# EAGLE design working (EAGLE 9.6.2)
COMPANY: ADAFRUIT INDUSTRIES; DRAWN: KTOWN; REV: A
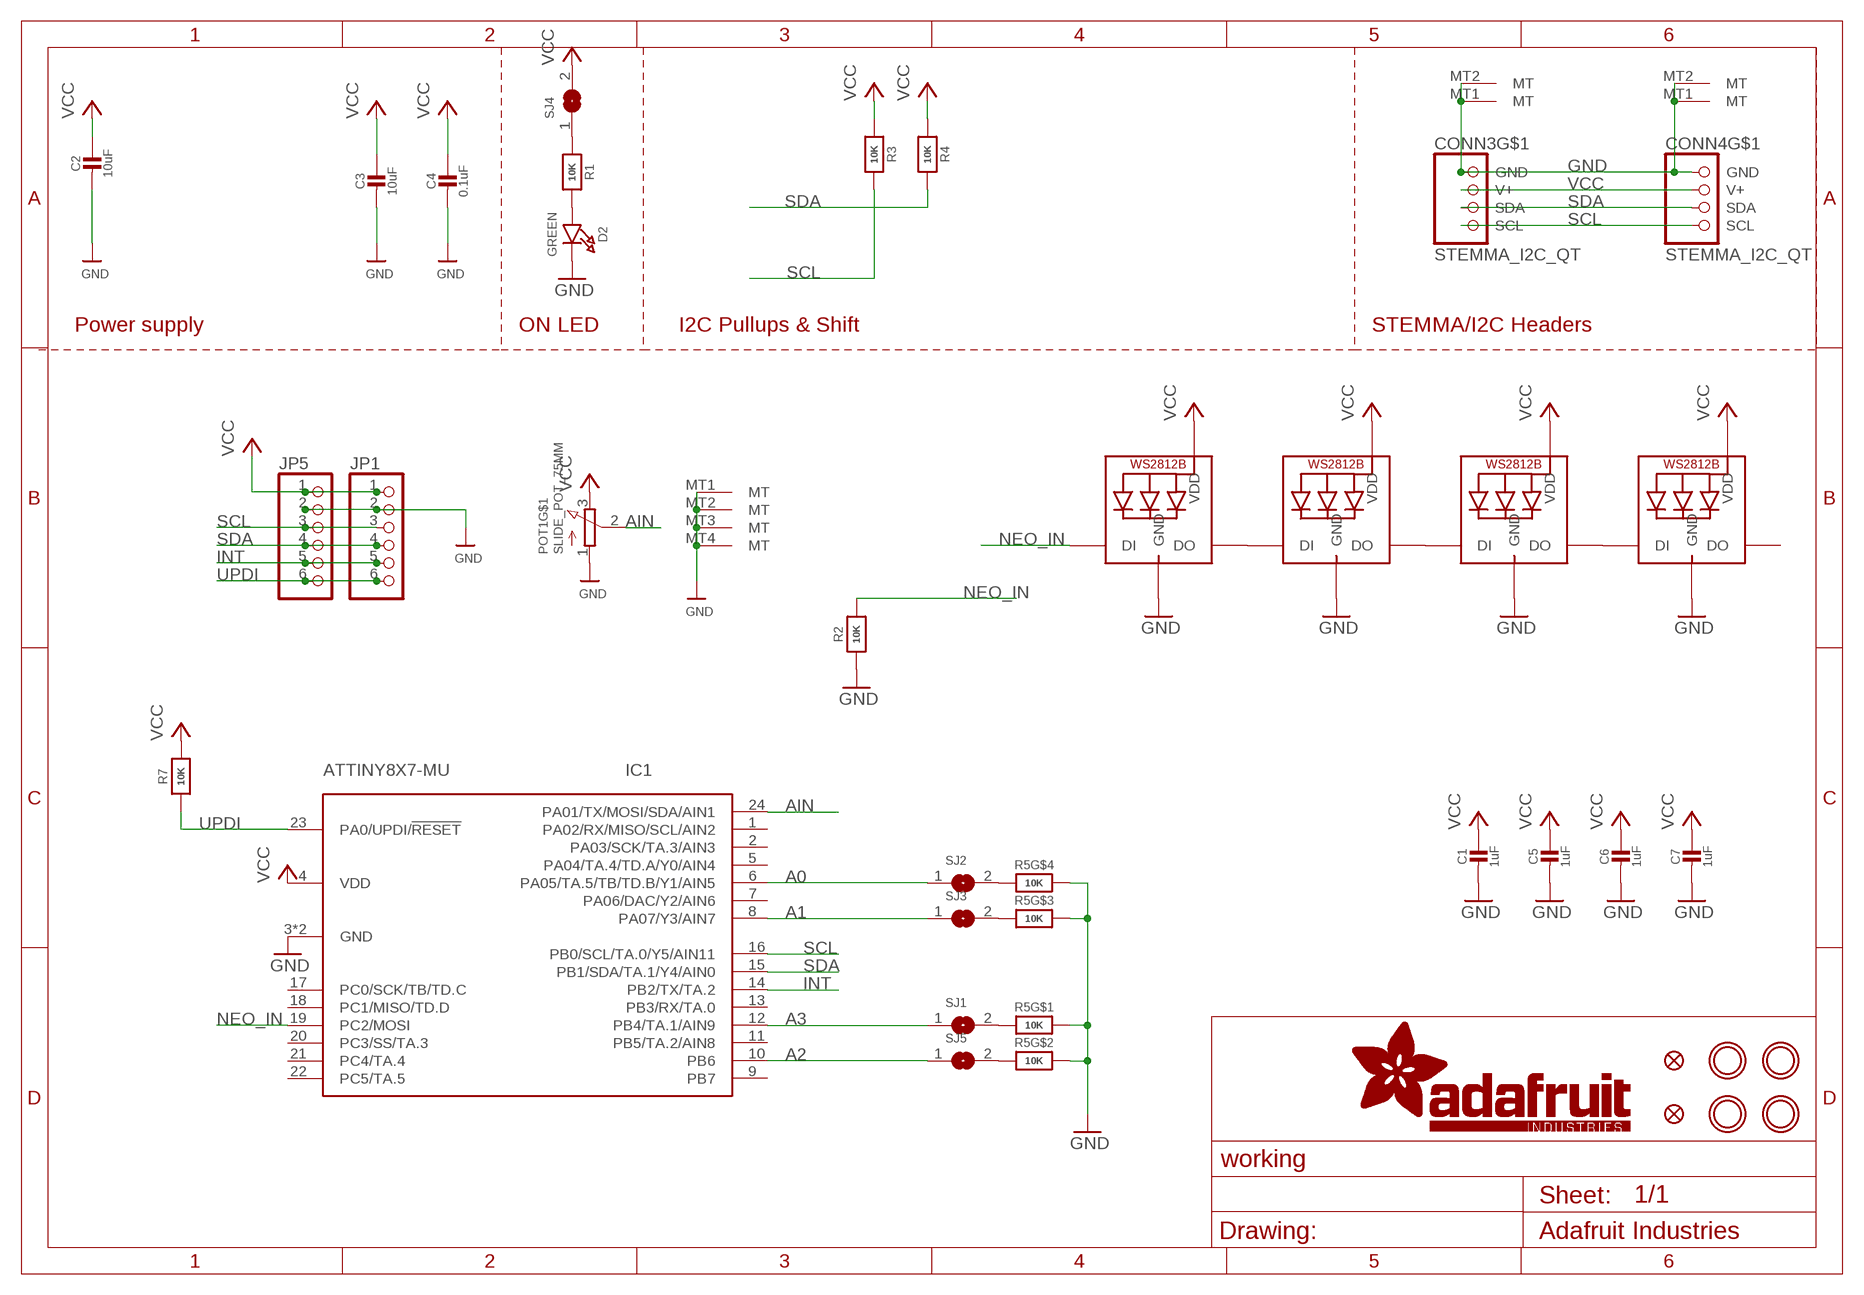
[diagram p0: schematic, sheet 1]

## Parts
C1  1uF  CAP_CERAMIC0603_NO  [0603-NO]
C2  10uF  CAP_CERAMIC0805-NOOUTLINE  [0805-NO]
C3  10uF  CAP_CERAMIC0805-NOOUTLINE  [0805-NO]
C4  0.1uF  CAP_CERAMIC0603_NO  [0603-NO]
C5  1uF  CAP_CERAMIC0603_NO  [0603-NO]
C6  1uF  CAP_CERAMIC0603_NO  [0603-NO]
C7  1uF  CAP_CERAMIC0603_NO  [0603-NO]
CONN3  STEMMA_I2C_QT  [JST_SH4]
CONN4  STEMMA_I2C_QT  [JST_SH4]
D2  GREEN  LED0603_NOOUTLINE  [CHIPLED_0603_NOOUTLINE]
FID1  FIDUCIAL_1MM  [FIDUCIAL_1MM]
FID2  FIDUCIAL_1MM  [FIDUCIAL_1MM]
IC1  ATTINY8X7-MU  [QFN24_4MM]
JP1  HEADER-1X670MIL  [1X06_ROUND_70]
JP5  HEADER-1X670MIL  [1X06_ROUND_70]
LED1  WS2812B_SK6812E  [NEO3535_REVERSE]
LED2  WS2812B_SK6812E  [NEO3535_REVERSE]
LED3  WS2812B_SK6812E  [NEO3535_REVERSE]
LED4  WS2812B_SK6812E  [NEO3535_REVERSE]
POT1  SLIDE_POT_75MM  [SLIDE_POT_75MM]
R1  10K  RESISTOR_0603_NOOUT  [0603-NO]
R2  10K  RESISTOR_0603_NOOUT  [0603-NO]
R3  10K  RESISTOR_0603_NOOUT  [0603-NO]
R4  10K  RESISTOR_0603_NOOUT  [0603-NO]
R5  10K  RESISTOR_4PACK  [RESPACK_4X0603]
R7  10K  RESISTOR_0603_NOOUT  [0603-NO]
SJ1  SOLDERJUMPERCLOSED  [SOLDERJUMPER_CLOSEDWIRE]
SJ2  SOLDERJUMPERCLOSED  [SOLDERJUMPER_CLOSEDWIRE]
SJ3  SOLDERJUMPERCLOSED  [SOLDERJUMPER_CLOSEDWIRE]
SJ4  SOLDERJUMPERCLOSED  [SOLDERJUMPER_CLOSEDWIRE]
SJ5  SOLDERJUMPERCLOSED  [SOLDERJUMPER_CLOSEDWIRE]
U$3  MOUNTINGHOLE2.5  [MOUNTINGHOLE_2.5_PLATED]
U$17  MOUNTINGHOLE2.5  [MOUNTINGHOLE_2.5_PLATED]
U$19  MOUNTINGHOLE2.5  [MOUNTINGHOLE_2.5_PLATED]
U$21  MOUNTINGHOLE2.5  [MOUNTINGHOLE_2.5_PLATED]

## Nets
A0: IC1.6(PA05/TA.5/TB/TD.B/Y1/AIN5) SJ2.1
A1: IC1.8(PA07/Y3/AIN7) SJ3.1
A2: IC1.10(PB6) SJ5.1
A3: IC1.12(PB4/TA.1/AIN9) SJ1.1
AIN: IC1.24(PA01/TX/MOSI/SDA/AIN1) POT1.2(S)
GND: C1.2 C2.2 C3.2 C4.2 C5.2 C6.2 C7.2 CONN3.1(GND) CONN3.MT1(MT) CONN3.MT2(MT) CONN4.1(GND) CONN4.MT1(MT) CONN4.MT2(MT) D2.C IC1.3(GND) IC1.THERM(GND) JP1.2 JP5.2 LED1.3-GND(GND) LED2.3-GND(GND) LED3.3-GND(GND) LED4.3-GND(GND) POT1.1(A) POT1.MT1(MT) POT1.MT2(MT) POT1.MT3(MT) POT1.MT4(MT) R2.1 R5.5 R5.6 R5.7 R5.8
INT: IC1.14(PB2/TX/TA.2) JP1.5 JP5.5
N$1: D2.A R1.2
N$2: LED1.2-DOUT(DO) LED2.4-DIN(DI)
N$3: LED2.2-DOUT(DO) LED3.4-DIN(DI)
N$4: LED3.2-DOUT(DO) LED4.4-DIN(DI)
N$5: R5.1 SJ1.2
N$6: R5.2 SJ5.2
N$7: R5.3 SJ3.2
N$8: R5.4 SJ2.2
N$9 [power]: R1.1 SJ4.1
NEO_IN: IC1.19(PC2/MOSI) LED1.4-DIN(DI) R2.2
SCL: CONN3.4(SCL) CONN4.4(SCL) IC1.16(PB0/SCL/TA.0/Y5/AIN11) JP1.3 JP5.3 R3.2
SDA: CONN3.3(SDA) CONN4.3(SDA) IC1.15(PB1/SDA/TA.1/Y4/AIN0) JP1.4 JP5.4 R4.2
UPDI: IC1.23(PA0/UPDI/!RESET) JP1.6 JP5.6 R7.1
VCC [power]: C1.1 C2.1 C3.1 C4.1 C5.1 C6.1 C7.1 CONN3.2(V+) CONN4.2(V+) IC1.4(VDD) JP1.1 JP5.1 LED1.1-VDD(VDD) LED2.1-VDD(VDD) LED3.1-VDD(VDD) LED4.1-VDD(VDD) POT1.3(E) R3.1 R4.1 R7.2 SJ4.2
Unconnected: IC1.1(PA02/RX/MISO/SCL/AIN2) IC1.2(PA03/SCK/TA.3/AIN3) IC1.5(PA04/TA.4/TD.A/Y0/AIN4) IC1.7(PA06/DAC/Y2/AIN6) IC1.9(PB7) IC1.11(PB5/TA.2/AIN8) IC1.13(PB3/RX/TA.0) IC1.17(PC0/SCK/TB/TD.C) IC1.18(PC1/MISO/TD.D) IC1.20(PC3/SS/TA.3) IC1.21(PC4/TA.4) IC1.22(PC5/TA.5) LED4.2-DOUT(DO)

## Notes on the sheet
- Power supply | ON LED | I2C Pullups & Shift | STEMMA/I2C Headers

## Library data of the parts
C1-C7 = microbuilder:CAP_CERAMIC: Ceramic Capacitors For new designs, use the packages preceded by an '_' character since they are more reliable: The following footprints should be used on most boards: _0402 - Standard footprint for regular board layouts _0603 - Standard footprint for regular board layouts _0805 - Standard footprint for regular board layouts _1206 - Standard footprint for regular board layouts For extremely tight-pitch boards where space is at a premium, the following 'micro-pitch' footprints can be used (smaller pads, no silkscreen outline, etc.): _0402MP - Micro-pitch footprint for very dense/compact boards _0603MP - Micro-pitch footprint for very dense/compact boards _0805MP - Micro-pitch footprint for very dense/compact boards _1206MP - Micro-pitch footprint for very dense/compact boards
CONN3 CONN4 = microbuilder:STEMMA_I2C
D2 = microbuilder:LED: LED 0603 - 0603 Surface Mount Package 2mA: Green LED - Low Power (3.9mcd, 2ma, 1.7Vf) - Digikey: 475-2709-2-ND Orange LED - Low Power (9.8mcd, 2ma, 1.8Vf) - Digikey: 475-1194-2-ND Red LED - Low Power (5mcd, 2ma, 1.8Vf) - Digikey: 475-1195-2-ND Yellow LED - Low Power (7mcd, 2ma, 1.8Vf) - Digikey: 475-1196-2-ND 5mA: Blue LED - Low Power (17mcd, 5ma, 2.9Vf) - Digikey: LNJ937W8CRACT-ND 0805 - 0805 Surface Mount Package 2mA: Red LED (8.8mcd, 2mA, 1.8Vf, Clear) - Low Power [Digikey: 475-2510-1-ND] Green LED (5mcd, 2mA, 1.8Vf, Clear) - Low Power [Digikey: 475-2730-1-ND] Yellow LED (11.3mcd, 2mA, 1.8Vf, Clear) - Low Power [Digikey: 475-2555-1-ND] 20mA: Red LED (104mcd, 20mA, Diffused) - LS R976 [Digikey: 475-1278-6-ND] Red LED (12mcd, 20mA, 2.0Vf, Clear) - APT2012EC [Digikey: 754-1128-1-ND] Green LED (15mcd, 20mA, 2.2Vf, Clear) - APT2012GC [Digikey: 754-1131-1-ND] Orange LED (160mcd, 20mA, 2.1Vf, Clear) - APT2012SECK [Digikey: 754-1130-1-ND] 1206 - 1206 Surface Mount Package Green LED (26mcd, 20mA, Diffused) - LG N971 [Digikey: 475-1407-6-ND] Red LED (15mcd, 20mA, Diffused) - LH N974 [Digikey: 475-1416-6-ND] Cree - Cree High-Power Surface Mount LEDs XPEBWT-L1-0000-00D50 - White 111lm 350mA 2.9Vf 6200K 110° XTEAWT-00-0000-00000LEE3 - White 114lm 350mA 2.85Vf 5000K 115° Everlight - Everlight 45-21 Series Surface Mount LEDs 45-21/QK2C-B2832AC2CB2/2T - Warm White 2000mcd 20mA 3.25Vf 3050K 120° 45-21/LK2C-B38452C4CB2/2T - Nuetral White 2000mcd 20mA 3.25Vf 4150K 120° 45-21/LK2C-B50634C6CB2/2T - Cold White 2200mcd 20mA 3.25Vf 5650K 120° PLCC2 Reverse Mount LS T77K-J1L2-1-0-2-R18-Z - Red 11.25mcd 2mA 1.8Vf 630nm 120° LO T77K-L1M2-24-Z - Orange 19.6mcd 2mA 1.8Vf 606nm 120° LY T77K-K2M1-26-Z - Yellow 15.7mcd 2mA 1.8Vf 587nm 120°
FID1 FID2 = microbuilder:FIDUCIAL: Fiducial Alignment Points Various fiducial points for machine vision alignment.; BOM: EXCLUDE
IC1 = adafruit_micro:ATTINY8X7
JP1 JP5 = microbuilder:HEADER-1X6: PIN HEADER
LED1-LED4 = microbuilder:WS2812B
POT1 = adafruit_electromech:SLIDE_POT
R1-R4 R7 = microbuilder:RESISTOR: Resistors For new designs, use the packages preceded by an '_' character since they are more reliable: The following footprints should be used on most boards: _0402 - Standard footprint for regular board layouts _0603 - Standard footprint for regular board layouts _0805 - Standard footprint for regular board layouts _1206 - Standard footprint for regular board layouts For extremely tight-pitch boards where space is at a premium, the following 'micro-pitch' footprints can be used (smaller pads, no silkscreen outline, etc.): _0402MP - Micro-pitch footprint for very dense/compact boards _0603MP - Micro-pitch footprint for very dense/compact boards _0805MP - Micro-pitch footprint for very dense/compact boards _1206MP - Micro-pitch footprint for very dense/compact boards
R5 = microbuilder:RESISTOR_4PACK: Resistor Packs (4 resistors) 4 x 0603 10K 1/16W - Digikey: YC164J-10KCT-ND
SJ1-SJ5 = microbuilder:SOLDERJUMPER: SMD Solder JUMPER Solder the two pads together to create a connection, or remove the solder to break it. REFLOW - Use this footprint for solder paste and reflow ovens. WAVE - Use this footprint for hand-soldering (larger pads). CLOSED - Has a trace between the two pads to ensure it is closed by default. The trace needs to be cut to disable the jumper, and can be closed again by creating a solder bridge between the two pads.
U$3 U$17 U$19 U$21 = adafruit_electromech:MOUNTINGHOLE: Mounting Hole For #2 screws (0.086"/2.18mm width, 0.094"/2.4mm hole) use 2.5mm; BOM: EXCLUDE

## Net classes
1 power: width 0.305 mm, drill 0.483 mm
2 lowpower: width 0.254 mm, drill 0.483 mm

## Board
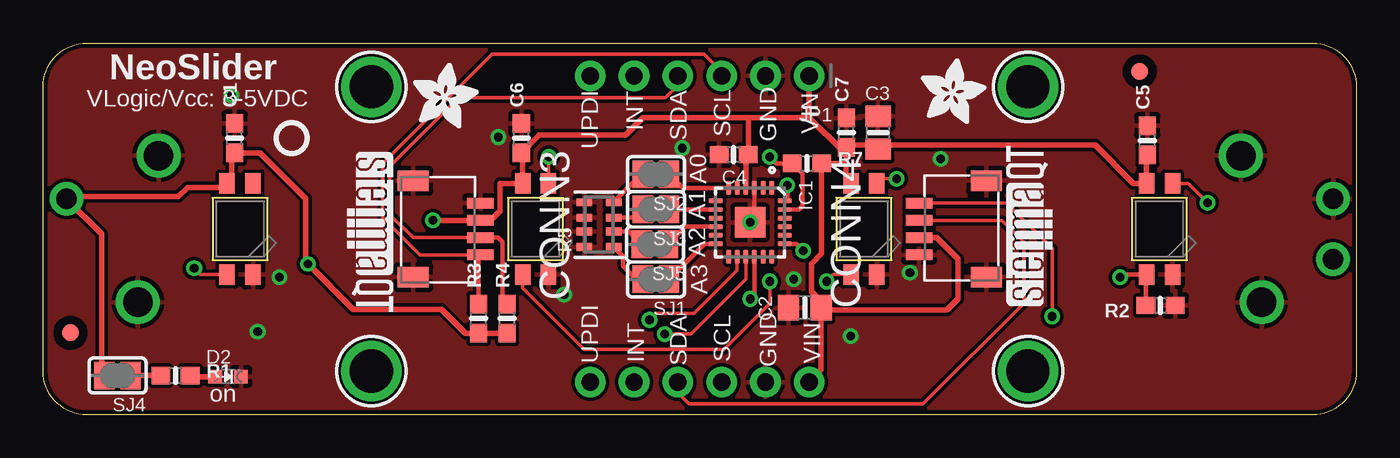
[diagram p1: board, top side]
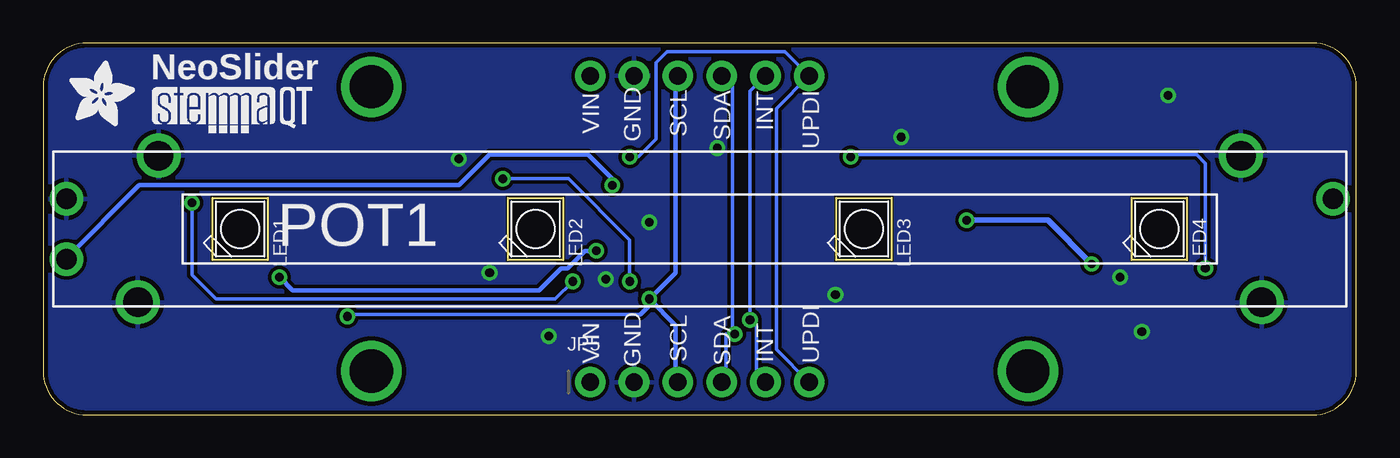
[diagram p2: board, bottom side, seen from below]

Size 76.2 x 21.59 mm. Coordinates in mm from the lower left corner, seen from the top.
Outline: 76.2,19.05 76.2,2.54 arc-90 73.66,0 2.54,0 arc-90 0,2.54 0,19.05 arc-90 2.54,21.59 73.66,21.59 arc-90 76.2,19.05
Copper layers (1*16): Top 0.035mm / dielectric 1.5mm / Bottom 0.035mm
Design rules "adafruit *": minimum track width 8mil, minimum drill 15.5mil, track to track 8mil, track to pad 8mil, pad to pad 8mil, via to via 8mil, smd to smd 8mil, copper to edge 10mil, drill to drill 8mil, minimum pad ring 10mil, minimum via ring 8mil, stop-mask expansion 2mil, vias tented up to drill 20mil, thermal gap 10mil

### Footprints (pad centres in the part's own frame; a part is rotated, then mirrored left to right if it is on the bottom)
0603-NO = smd 1.075 x 1: 1 -0.85,0; 2 0.85,0
0805-NO = smd 1.24 x 1.5: 1 -0.95,0; 2 0.95,0
JST_SH4 = smd 0.6 x 1.55: 1 -1.5,2.514; 2 -0.5,2.514; 3 0.5,2.514; 4 1.5,2.514 | smd 1.2 x 1.8: MT1 -2.8,-1.386; MT2 2.8,-1.386
CHIPLED_0603_NOOUTLINE = smd 0.8 x 0.8: A 0,-0.75; C 0,0.75
FIDUCIAL_1MM = smd 1 x 1: 1 0,0
QFN24_4MM = smd 0.8 x 0.28: 1 -2,1.25; 2 -2,0.75; 3 -2,0.25; 4 -2,-0.25; 5 -2,-0.75; 6 -2,-1.25; 13 2,-1.25; 14 2,-0.75; 15 2,-0.25; 16 2,0.25; 17 2,0.75; 18 2,1.25 | smd 0.28 x 0.8: 7 -1.25,-2; 8 -0.75,-2; 9 -0.25,-2; 10 0.25,-2; 11 0.75,-2; 12 1.25,-2; 19 1.25,2; 20 0.75,2; 21 0.25,2; 22 -0.25,2; 23 -0.75,2; 24 -1.25,2 | smd 1.778 x 1.778: THERM 0,0
1X06_ROUND_70 = drill 1 pad 1.778: 1 -6.35,0; 2 -3.81,0; 3 -1.27,0; 4 1.27,0; 5 3.81,0; 6 6.35,0
NEO3535_REVERSE = smd 1.2 x 0.9 bottom: 1-VDD 2.65,-0.75; 2-DOUT 2.65,0.75; 3-GND -2.65,0.75; 4-DIN -2.65,-0.75
SLIDE_POT_75MM = drill 1.2 pad 1.93: 1 -36.75,1.75; 2 -36.75,-1.75; 3 36.75,1.75 | drill 1.7: MT1 -31.4,4.25; MT2 31.4,4.25; MT3 -32.6,-4.25; MT4 32.6,-4.25
RESPACK_4X0603 = smd 0.45 x 0.9: 1 -1.3,-0.85; 2 -0.4,-0.85; 3 0.4,-0.85; 4 1.3,-0.85; 5 1.3,0.85; 6 0.4,0.85; 7 -0.4,0.85; 8 -1.3,0.85
SOLDERJUMPER_CLOSEDWIRE = smd 1.168 x 1.6: 1 -0.762,0; 2 0.762,0 | smd 0.635 x 0.203: WIRE 0,0
MOUNTINGHOLE_2.5_PLATED = drill 2.5 pad 3.2: P$1 0,0

### Placement (x,y rotation side)
C1  11.11,16.07 90 top
C2  44.2,6.22 180 top
C3  48.45,16.38 90 top
C4  40.07,15.11 180 top
C5  64.07,15.94 90 top
C6  27.75,16.07 90 top
C7  46.61,16.38 90 top
CONN3  22.86,10.79 270 top
CONN4  53.34,10.79 90 top
D2  10.73,2.22 270 top
FID1  63.63,19.94 0 top
FID2  1.59,4.76 0 top
IC1  41.02,11.18 270 top
JP1  38.1,19.69 180 top
JP5  38.1,1.9 0 bottom
LED1  64.77,10.79 90 bottom
LED2  47.62,10.79 90 bottom
LED3  28.58,10.79 90 bottom
LED4  11.43,10.79 90 bottom
POT1  38.1,10.79 0 bottom
R1  7.68,2.29 0 top
R2  64.83,6.35 180 top
R3  25.27,5.59 90 top
R4  26.92,5.59 90 top
R5  32.26,11.05 90 top
R7  44.32,14.61 0 top
SJ1  35.56,7.87 180 top
SJ2  35.56,13.97 180 top
SJ3  35.56,11.94 180 top
SJ4  4.32,2.29 180 top
SJ5  35.5,9.91 180 top
U$1  [ADAFRUIT_3.5MM]  74.68,16.76 0 bottom
U$2  [ADAFRUIT_3.5MM]  21.46,16.64 0 top
U$3  57.15,19.05 0 top
U$7  [STEMMAQT]  69.85,16.38 0 bottom
U$9  [ADAFRUIT_3.5MM]  50.93,16.89 0 top
U$17  19.05,19.05 0 top
U$19  57.15,2.54 0 top
U$21  19.05,2.54 0 top
U$25  [PCBFEAT-REV-040]  14.41,16.07 0 top
U$30  [STEMMAQT]  17.65,15.24 270 top
U$31  [STEMMAQT]  58.55,6.35 90 top

### Tracks (layer width: path | path; a pad name or v marks a point on that pad's centre or on a via)
A0
  Top 0.254: IC1.6 37.12,13.18 SJ2.1
A1
  Top 0.254: IC1.8 36.33,11.93 SJ3.1
A2
  Top 0.254: SJ5.1 37.28,10.93 IC1.10
A3
  Top 0.254: SJ1.1 38.37,9.93 IC1.12
AIN  (via drill 0.5)
  Top 0.254: v43.18,13.34 43.18,12.46 43.15,12.43 IC1.24
  Bottom 0.254: v43.18,13.34 43.18,13.72 44.58,15.11 50.29,15.11 52.07,13.34 70.61,13.34 74.85,9.1
  Bottom 0.305: 74.85,9.1 POT1.2
GND  (via drill 0.5)
  Top 0.254: IC1.3 41.27,11.68 41.02,11.43 IC1.THERM
  Top 0.305: IC1.THERM 40.77,11.18 40.51,10.92
  other vias: 10.92,18.54 13.72,8 12.45,4.83 30.23,6.98 37.08,15.49 52.07,14.86 46.86,4.57 50.29,8.25 26.42,16.13 41.02,11.18 43.56,7.87
  pour Top: 0,21.59 76.2,21.59 76.2,0 0,0
  pour Bottom: 0,21.59 76.2,21.59 76.2,0 0,0
INT  (via drill 0.5)
  Top 0.203: v35.18,5.51 35.56,5.89 37.77,5.89 40.27,8.39 IC1.14
  Bottom 0.203: JP5.5 34.8,2.41 34.8,5.13 v35.18,5.51 35.18,18.79 JP1.5
N$1
  Top 0.305: R1.2 8.6,2.22 D2.A
N$2  (via drill 0.5)
  Top 0.203: LED2.4-DIN 45.86,8.14 v45.47,7.75 | v67.56,12.32 66.44,13.45 LED1.2-DOUT
  Bottom 0.203: v45.47,7.75 46.48,6.73 66.17,6.73 67.56,8.13 v67.56,12.32
N$3  (via drill 0.5)
  Top 0.203: LED3.4-DIN 27.83,7.38 31.4,3.81 39.5,3.81 42.16,6.48 v42.16,7.75 | v49.53,13.72 48.65,13.72 LED2.2-DOUT
  Bottom 0.203: v49.53,13.72 45.72,13.72 42.16,10.16 v42.16,7.75
N$4  (via drill 0.5)
  Top 0.203: LED4.4-DIN 9.13,8.14 v8.76,8.51 | v29.34,14.99 29.34,13.46 LED3.2-DOUT
  Bottom 0.203: v8.76,8.51 8.76,14.61 9.27,15.11 29.21,15.11 v29.34,14.99
N$5
  Top 0.254: R5.1 33.66,9.2 33.66,8.64 34.42,7.87 SJ1.2
N$6
  Top 0.254: R5.2 33.99,10.65 SJ5.2
N$7
  Top 0.254: R5.3 34.31,11.45 SJ3.2
N$8
  Top 0.254: R5.4 34.73,13.97 SJ2.2
N$9
  Top 0.305: R1.1 SJ4.1
NEO_IN  (via drill 0.5)
  Top 0.254: R2.2 63.98,8.11 LED1.4-DIN 62.48,8.14 v62.48,8 | v44.11,9.53 43.71,9.93 IC1.19
  Bottom 0.254: v62.48,8 61.72,7.24 47.41,7.24 46.14,8.51 45.76,8.51 44.75,9.53 v44.11,9.53
SCL  (via drill 0.5)
  Top 0.203: CONN3.4 21.88,9.29 19.71,11.47 19.71,14.6 26.06,20.95 38.35,20.95 39.37,19.94 JP1.3 | CONN4.4 55.9,12.29 58.55,9.65 v58.55,5.71
  Top 0.254: CONN3.4 25.27,9.19 R3.2 | IC1.16 41.27,6.98 v41.02,6.73
  Bottom 0.203: v58.55,5.71 58.42,5.84 41.53,5.84
  Bottom 0.254: JP1.3 39.5,19.56 39.5,8.25 v41.02,6.73 | v41.02,6.73 41.02,6.35 41.53,5.84 | JP5.3 39.5,2.03 39.5,5.21 v41.02,6.73
SDA  (via drill 0.5)
  Top 0.203: IC1.15 40.77,7.88 37.59,4.7 v36.06,4.7 | JP5.4 36.83,1.27 37.47,0.63 51.05,0.63 56.9,6.48 56.9,10.03 55.63,11.29 CONN4.3 | JP1.4 36.83,19.13 36.12,18.41 24.1,18.41 20.11,14.43 20.11,11.64 21.46,10.29 CONN3.3
  Top 0.254: CONN3.3 26.41,10.29 26.67,10.03 26.67,6.69 R4.2
  Bottom 0.203: JP1.4 36.2,19.05 36.2,4.83 v36.06,4.7 36.58,4.7 36.58,2.16 JP5.4
UPDI  (via drill 0.5)
  Top 0.254: IC1.23 43.87,11.93 44.07,12.13 44.07,14.01 R7.1 42.55,14.61 v42.16,14.99
  Bottom 0.203: JP5.6 33.66,3.81 33.66,17.78 JP1.6 33.15,21.08 40.01,21.08 40.64,20.45 40.64,16 41.66,14.99 v42.16,14.99
VCC  (via drill 0.48)
  Top 0.305: C5.1 64.02,15.04 LED1.1-VDD 63.27,13.45 61.05,15.67 48.51,15.67 | CONN4.2 51.85,10.29 53.09,9.05 53.09,6.73 52.45,6.1 45.27,6.1 C2.1 | JP1.1 44.45,17.27 | 44.45,17.27 46.4,15.32 C7.1 | C7.1 46.61,14.57 46.57,14.61 | 40.92,17.27 34.8,17.27 33.78,16.26 28.79,16.26 C6.1 27.83,15.14 LED3.1-VDD 26.52,13.45 26.51,13.43 26.51,11.85 25.95,11.29 CONN3.2 v22.61,11.29 v22.61,11.3 | 40.92,17.27 44.45,17.27 | 48.51,15.67 46.74,15.67 C7.1 | C2.1 45.15,2.6 JP5.1 | 40.92,17.27 C4.1 40.7,14.9 40.77,14.83 IC1.4 | C3.1 48.45,15.6 48.51,15.67 | R4.1 R3.1 24.51,4.74 23.11,6.13 18,6.13 v15.37,8.76 15.24,8.89 15.24,12.57 12.6,15.21 C1.1 10.93,15.04 10.93,13.7 LED4.1-VDD 10.44,13.21 8.38,13.21 7.85,12.67 1.48,12.67 POT1.3 3.4,10.49 3.4,2.44 SJ4.2 | 46.57,14.61 R7.2 45.17,9.36 44.58,8.76 44.58,7.17 45.15,6.6 C2.1 | 46.57,14.61 46.57,13.75 LED2.1-VDD
  Bottom 0.305: v22.61,11.3 17.91,11.3 v15.37,8.76

### Text on the board
tPlace: NeoSlider | VLogic/Vcc: 3-5VDC | INT | SDA | SCL | GND | VIN | UPDI | A0 | A1 | A2 | A3 | UPDI | SDA | SCL | GND | INT | VIN | on
bPlace: NeoSlider | INT | SDA | SCL | GND | VIN | UPDI | UPDI | SDA | SCL | GND | INT | VIN